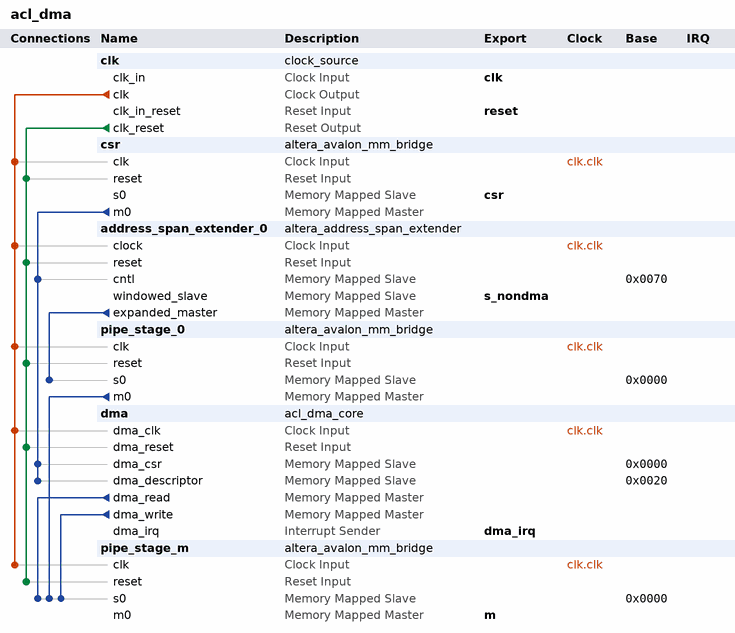
[diagram p0: system contents]
# Platform Designer (Qsys) system acl_dma, Stratix V Unknown
# Parameters at their usual value, and those the tool derives, are not listed.
package require -exact qsys 12.1
create_system acl_dma
set_project_property DEVICE_FAMILY {Stratix V}
set_project_property DEVICE Unknown

add_instance clk clock_source 12.1
set_instance_parameter_value clk clockFrequency 100000000
set_instance_parameter_value clk resetSynchronousEdges DEASSERT

add_instance csr altera_avalon_mm_bridge 12.1
set_instance_parameter_value csr DATA_WIDTH 64
set_instance_parameter_value csr ADDRESS_WIDTH 10
set_instance_parameter_value csr ADDRESS_UNITS SYMBOLS
set_instance_parameter_value csr MAX_PENDING_RESPONSES 1

add_instance address_span_extender_0 altera_address_span_extender 1.2
set_instance_parameter_value address_span_extender_0 DATA_WIDTH 512
set_instance_parameter_value address_span_extender_0 MASTER_ADDRESS_WIDTH 47
set_instance_parameter_value address_span_extender_0 SLAVE_ADDRESS_WIDTH 10
set_instance_parameter_value address_span_extender_0 BURSTCOUNT_WIDTH 1
set_instance_parameter_value address_span_extender_0 MASTER_ADDRESS_DEF 0
set_instance_parameter_value address_span_extender_0 TERMINATE_SLAVE_PORT false
set_instance_parameter_value address_span_extender_0 MAX_PENDING_READS 16

add_instance pipe_stage_0 altera_avalon_mm_bridge 12.1
set_instance_parameter_value pipe_stage_0 DATA_WIDTH 512
set_instance_parameter_value pipe_stage_0 ADDRESS_WIDTH 47
set_instance_parameter_value pipe_stage_0 ADDRESS_UNITS SYMBOLS
set_instance_parameter_value pipe_stage_0 MAX_BURST_SIZE 16
set_instance_parameter_value pipe_stage_0 MAX_PENDING_RESPONSES 16
set_instance_parameter_value pipe_stage_0 PIPELINE_COMMAND 0

add_instance dma acl_dma_core 1.0
set_instance_parameter_value dma DATA_WIDTH 512
set_instance_parameter_value dma BURST_SIZE 16
set_instance_parameter_value dma ADDR_WIDTH 48

add_instance pipe_stage_m altera_avalon_mm_bridge 12.1
set_instance_parameter_value pipe_stage_m DATA_WIDTH 512
set_instance_parameter_value pipe_stage_m ADDRESS_WIDTH 47
set_instance_parameter_value pipe_stage_m ADDRESS_UNITS SYMBOLS
set_instance_parameter_value pipe_stage_m MAX_BURST_SIZE 16
set_instance_parameter_value pipe_stage_m MAX_PENDING_RESPONSES 64

# connections
add_connection clk.clk address_span_extender_0.clock clock
add_connection clk.clk csr.clk clock
add_connection clk.clk dma.dma_clk clock
add_connection clk.clk pipe_stage_0.clk clock
add_connection clk.clk pipe_stage_m.clk clock
add_connection clk.clk_reset address_span_extender_0.reset reset
add_connection clk.clk_reset csr.reset reset
add_connection clk.clk_reset dma.dma_reset reset
add_connection clk.clk_reset pipe_stage_0.reset reset
add_connection clk.clk_reset pipe_stage_m.reset reset
add_connection address_span_extender_0.expanded_master pipe_stage_0.s0 avalon
set_connection_parameter_value address_span_extender_0.expanded_master/pipe_stage_0.s0 baseAddress 0x0000
add_connection csr.m0 address_span_extender_0.cntl avalon
set_connection_parameter_value csr.m0/address_span_extender_0.cntl baseAddress 0x0070
add_connection csr.m0 dma.dma_csr avalon
set_connection_parameter_value csr.m0/dma.dma_csr baseAddress 0x0000
add_connection csr.m0 dma.dma_descriptor avalon
set_connection_parameter_value csr.m0/dma.dma_descriptor baseAddress 0x0020
add_connection dma.dma_read pipe_stage_m.s0 avalon
set_connection_parameter_value dma.dma_read/pipe_stage_m.s0 baseAddress 0x0000
add_connection dma.dma_write pipe_stage_m.s0 avalon
set_connection_parameter_value dma.dma_write/pipe_stage_m.s0 baseAddress 0x0000
add_connection pipe_stage_0.m0 pipe_stage_m.s0 avalon
set_connection_parameter_value pipe_stage_0.m0/pipe_stage_m.s0 baseAddress 0x0000

# exported interfaces
add_interface dma_irq interrupt sender
set_interface_property dma_irq EXPORT_OF dma.dma_irq
add_interface reset reset sink
set_interface_property reset EXPORT_OF clk.clk_in_reset
add_interface clk clock sink
set_interface_property clk EXPORT_OF clk.clk_in
add_interface m avalon master
set_interface_property m EXPORT_OF pipe_stage_m.m0
add_interface csr avalon slave
set_interface_property csr EXPORT_OF csr.s0
add_interface s_nondma avalon slave
set_interface_property s_nondma EXPORT_OF address_span_extender_0.windowed_slave

save_system acl_dma.qsys
